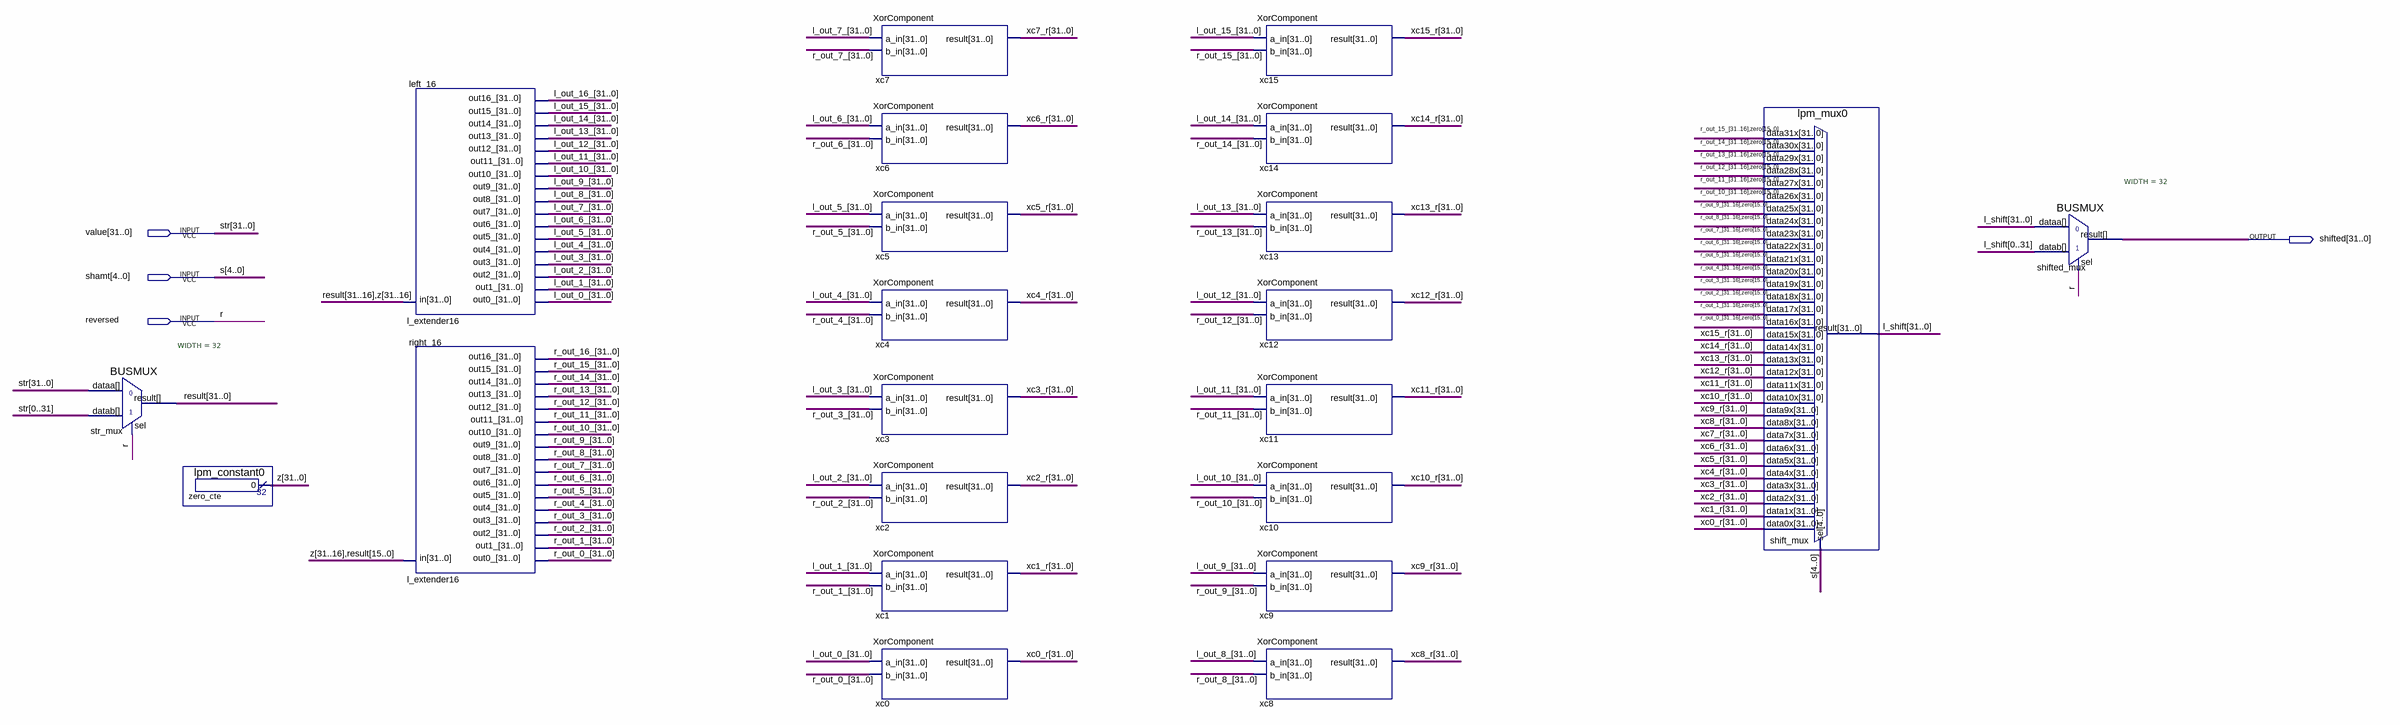
[diagram p0: schematic sheet]
// Quartus schematic cp_dst.bdf as structural Verilog: 22 symbols, 4 pins
module cp_dst (
  input  [31:0] value,
  input  [4:0] shamt,
  input  reversed,
  output [31:0] shifted
);

  wire [15:0] zero;
  wire [31:0] l_out_0_, l_out_1_, l_out_2_, l_out_3_, l_out_4_, l_out_5_, l_out_6_, l_out_7_, l_out_8_,
       l_out_9_, l_out_10_, l_out_11_, l_out_12_, l_out_13_, l_out_14_, l_out_15_, l_out_16_, l_shift,
       r_out_0_, r_out_1_, r_out_2_, r_out_3_, r_out_4_, r_out_5_, r_out_6_, r_out_7_, r_out_8_, r_out_9_,
       r_out_10_, r_out_11_, r_out_12_, r_out_13_, r_out_14_, r_out_15_, r_out_16_, result, xc0_r, xc1_r,
       xc2_r, xc3_r, xc4_r, xc5_r, xc6_r, xc7_r, xc8_r, xc9_r, xc10_r, xc11_r, xc12_r, xc13_r, xc14_r,
       xc15_r, z;

  BUSMUX #(.WIDTH(32)) str_mux (
    .datab({value[0], value[1], value[2], value[3], value[4], value[5], value[6], value[7], value[8], value[9], value[10], value[11], value[12], value[13], value[14], value[15], value[16], value[17], value[18], value[19], value[20], value[21], value[22], value[23], value[24], value[25], value[26], value[27], value[28], value[29], value[30], value[31]}),
    .sel(reversed), .dataa(value), .result(result));
  lpm_constant0 zero_cte (.result(z));
  l_extender16 left_16 (
    .in({result[31:16], z[31:16]}), .out0_(l_out_0_), .out1_(l_out_1_), .out2_(l_out_2_), .out3_(l_out_3_),
    .out4_(l_out_4_), .out5_(l_out_5_), .out6_(l_out_6_), .out7_(l_out_7_), .out8_(l_out_8_),
    .out9_(l_out_9_), .out10_(l_out_10_), .out11_(l_out_11_), .out12_(l_out_12_), .out13_(l_out_13_),
    .out14_(l_out_14_), .out15_(l_out_15_), .out16_(l_out_16_));
  l_extender16 right_16 (
    .in({z[31:16], result[15:0]}), .out0_(r_out_0_), .out1_(r_out_1_), .out2_(r_out_2_), .out3_(r_out_3_),
    .out4_(r_out_4_), .out5_(r_out_5_), .out6_(r_out_6_), .out7_(r_out_7_), .out8_(r_out_8_),
    .out9_(r_out_9_), .out10_(r_out_10_), .out11_(r_out_11_), .out12_(r_out_12_), .out13_(r_out_13_),
    .out14_(r_out_14_), .out15_(r_out_15_), .out16_(r_out_16_));
  XorComponent xc7 (.a_in(l_out_7_), .b_in(r_out_7_), .result(xc7_r));
  XorComponent xc6 (.a_in(l_out_6_), .b_in(r_out_6_), .result(xc6_r));
  XorComponent xc5 (.a_in(l_out_5_), .b_in(r_out_5_), .result(xc5_r));
  XorComponent xc4 (.a_in(l_out_4_), .b_in(r_out_4_), .result(xc4_r));
  XorComponent xc3 (.a_in(l_out_3_), .b_in(r_out_3_), .result(xc3_r));
  XorComponent xc2 (.a_in(l_out_2_), .b_in(r_out_2_), .result(xc2_r));
  XorComponent xc1 (.a_in(l_out_1_), .b_in(r_out_1_), .result(xc1_r));
  XorComponent xc0 (.a_in(l_out_0_), .b_in(r_out_0_), .result(xc0_r));
  XorComponent xc15 (.a_in(l_out_15_), .b_in(r_out_15_), .result(xc15_r));
  XorComponent xc14 (.a_in(l_out_14_), .b_in(r_out_14_), .result(xc14_r));
  XorComponent xc13 (.a_in(l_out_13_), .b_in(r_out_13_), .result(xc13_r));
  XorComponent xc12 (.a_in(l_out_12_), .b_in(r_out_12_), .result(xc12_r));
  XorComponent xc11 (.a_in(l_out_11_), .b_in(r_out_11_), .result(xc11_r));
  XorComponent xc10 (.a_in(l_out_10_), .b_in(r_out_10_), .result(xc10_r));
  XorComponent xc9 (.a_in(l_out_9_), .b_in(r_out_9_), .result(xc9_r));
  XorComponent xc8 (.a_in(l_out_8_), .b_in(r_out_8_), .result(xc8_r));
  lpm_mux0 shift_mux (
    .data31x({r_out_15_[31:16], zero}), .data30x({r_out_14_[31:16], zero}),
    .data29x({r_out_13_[31:16], zero}), .data28x({r_out_12_[31:16], zero}),
    .data27x({r_out_11_[31:16], zero}), .data26x({r_out_10_[31:16], zero}),
    .data25x({r_out_9_[31:16], zero}), .data24x({r_out_8_[31:16], zero}), .data23x({r_out_7_[31:16], zero}),
    .data22x({r_out_6_[31:16], zero}), .data21x({r_out_5_[31:16], zero}), .data20x({r_out_4_[31:16], zero}),
    .data19x({r_out_3_[31:16], zero}), .data18x({r_out_2_[31:16], zero}), .data17x({r_out_1_[31:16], zero}),
    .data16x({r_out_0_[31:16], zero}), .data15x(xc15_r), .data14x(xc14_r), .data13x(xc13_r),
    .data12x(xc12_r), .data11x(xc11_r), .data10x(xc10_r), .data9x(xc9_r), .data8x(xc8_r), .data7x(xc7_r),
    .data6x(xc6_r), .data5x(xc5_r), .data4x(xc4_r), .data3x(xc3_r), .data2x(xc2_r), .data1x(xc1_r),
    .data0x(xc0_r), .sel(shamt), .result(l_shift));
  BUSMUX #(.WIDTH(32)) shifted_mux (
    .datab({l_shift[0], l_shift[1], l_shift[2], l_shift[3], l_shift[4], l_shift[5], l_shift[6], l_shift[7], l_shift[8], l_shift[9], l_shift[10], l_shift[11], l_shift[12], l_shift[13], l_shift[14], l_shift[15], l_shift[16], l_shift[17], l_shift[18], l_shift[19], l_shift[20], l_shift[21], l_shift[22], l_shift[23], l_shift[24], l_shift[25], l_shift[26], l_shift[27], l_shift[28], l_shift[29], l_shift[30], l_shift[31]}),
    .sel(reversed), .dataa(l_shift), .result(shifted));

  // Other names for the same wires on the sheet: r = reversed; s[4:0] = shamt; str[31:0] = value
endmodule
